# Altium schematic sheet Sheet_1 copy_2022-02-27.schdoc
size 312 x 225 mm
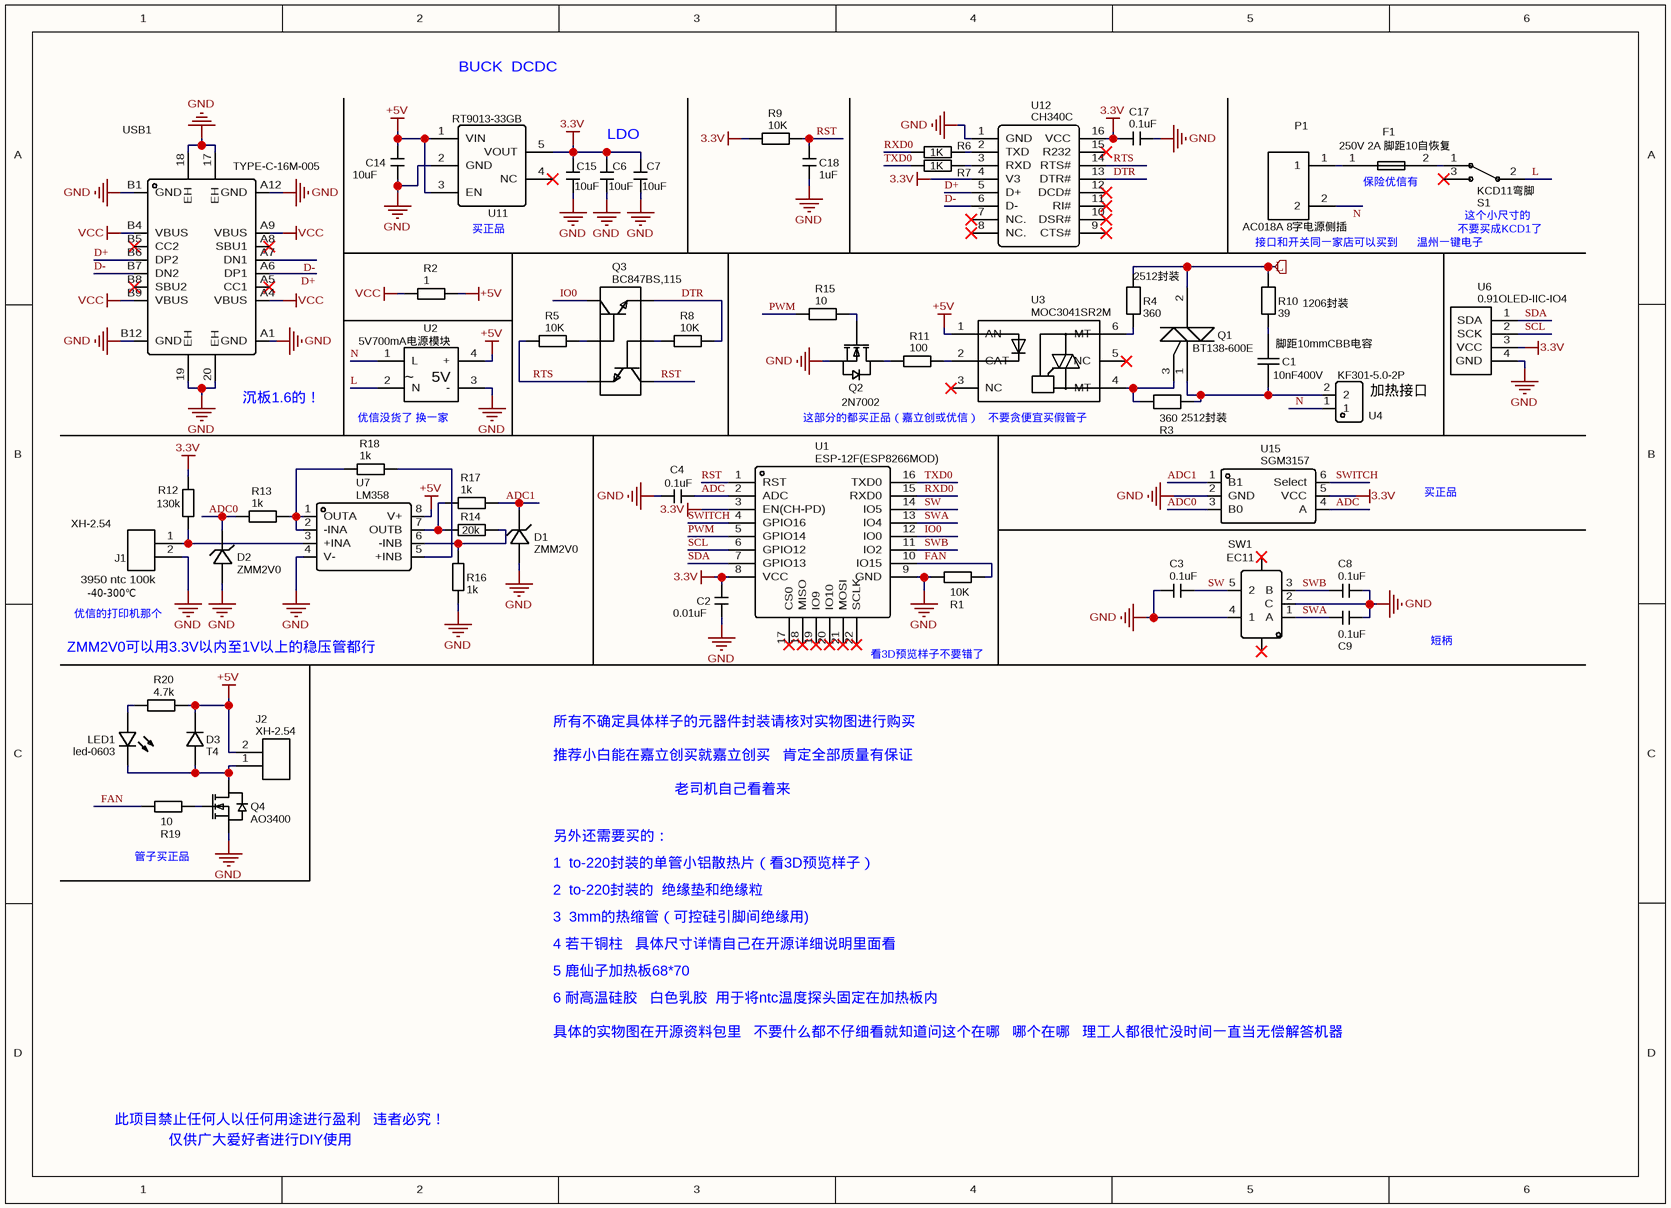
[diagram p0: Sheet_1 copy_2022-02-27.schdoc]

## Parts
C1  10nF400V  [CAP-TH_L13.0-W6.5-P10.00-D1.2]
C2  0.01uF  [CAP 0603]
C3  0.1uF  [CAP 0603]
C4  0.1uF  [CAP 0603]
C6  10uF  [CAP 0603]
C7  10uF  [CAP 0603]
C8  0.1uF  [CAP 0603]
C9  0.1uF  [CAP 0603]
C14  10uF  [CAP 0603]
C15  10uF  [CAP 0603]
C17  0.1uF  [CAP 0603]
C18  1uF  [CAP 0603]
D1  ZMM2V0  [LL-34_L3.5-W1.5-RD]
D2  ZMM2V0  [LL-34_L3.5-W1.5-RD]
D3  T4  [SOD-323_L1.8-W1.3-LS2.5-RD]
F1  250V 2A 脚距10自恢复  [FUSE-TH_L17.5-W3.1-P10.50-D0.8-S2.30]
J1  XH-2.54  [XH-2.54-TH-2P]
J2  XH-2.54  [XH-2.54-TH-2P]
LED1  led-0603  [LED-0603]
P1  AC018A 8字电源侧插  [8字电源座侧插]
Q1  BT138-600E  [TO-220-3_L10.0-W4.5-P2.54-L]
Q2  2N7002  [SOT-23-3_L2.9-W1.3-P1.90-LS2.4-BR]
Q3  BC847BS,115  [SOT-363_L2.0-W1.3-P0.65-LS2.1-TL]
Q4  AO3400  [SOT-23-3_L2.9-W1.3-P1.90-LS2.4-BR]
R1  10K  [RES-0603]
R2  1  [RES-0603]
R3  360  [R2512]
R4  360  [R2512]
R5  10K  [RES-0603]
R6  1K  [RES-0603]
R7  1K  [RES-0603]
R8  10K  [RES-0603]
R9  10K  [RES-0603]
R10  39  [R1206]
R11  100  [RES-0603]
R12  130k  [RES-0603]
R13  1k  [RES-0603]
R14  20k  [RES-0603]
R15  10  [RES-0603]
R16  1k  [RES-0603]
R17  1k  [RES-0603]
R18  1k  [RES-0603]
R19  10  [RES-0603]
R20  4.7k  [RES-0603]
S1  KCD11弯脚  [船型开关15-10]
SW1  EC11  [SW-TH_5P-L11.8-W12.0-P2.50-LS14.5]
U1  ESP-12F(ESP8266MOD)  [WIFIM-SMD_ESP-12F-ESP8266MOD]
U2  5V700mA电源模块  [5V700MA]
U3  MOC3041SR2M  [SOP-6_L8.5-W6.4-P2.54-LS9.2-BL]
U4  KF301-5.0-2P  [CONN-TH_P5.00_KF301-5.0-2P]
U6  0.91OLED-IIC-IO4  [0.91-OLED-IIC-12832]
U7  LM358  [SOP-8_L4.9-W3.9-P1.27-LS6.0-BL]
U11  RT9013-33GB  [SOT-23-5_L3.0-W1.7-P0.95-LS2.8-BR]
U12  CH340C  [SOP-16_L10.0-W3.9-P1.27-LS6.0-BL]
U15  SGM3157  [SC-70-6_L2.2-W1.3-P0.65-LS2.2-BR]
USB1  TYPE-C-16M-005  [USB-C-SMD_TYPE-C-16M-005]

## Ports
L (in)

## Nets
3.3V: C2.2 C6.1 C7.1 C15.1 C17.1 R9.1 R12.2 U1.3(EN(CH-PD)) U1.8(VCC) U6.3(VCC) U11.5(VOUT) U12.4(V3) U12.16(VCC) U15.5(VCC)
+5V: C14.1 D3.1(C) J2.2 R2.2 R20.1 U2.4(+) U3.1(AN) U7.8(V+) U11.1(VIN) U11.3(EN)
GND: C2.1 C3.1 C4.1 C6.2 C7.2 C8.2 C9.2 C14.2 C15.2 C17.2 C18.2 D1.2(A) D2.2(A) J1.2 Q2.2(S) Q4.2(S) R1.2 R16.1 SW1.2(C) SW1.4(1) U1.9(GND) U2.3(-) U6.4(GND) U7.4(V-) U11.2(GND) U12.1(GND) U15.2(GND) USB1.17(EH) USB1.18(EH) USB1.19(EH) USB1.20(EH) USB1.A1(GND) USB1.A12(GND) USB1.B1(GND) USB1.B12(GND)
VCC: R2.1 USB1.A4(VBUS) USB1.A9(VBUS) USB1.B4(VBUS) USB1.B9(VBUS)
ADC: C4.2 U1.2(ADC) U15.4(A)
ADC0: D2.1(C) R13.1 U15.3(B0)
ADC1: D1.1(C) R17.2 U15.1(B1)
D+: U12.5(D+) USB1.A6(DP1) USB1.B6(DP2)
D-: U12.6(D-) USB1.A7(DN1) USB1.B7(DN2)
DTR: Q3.4 R8.1 U12.13(DTR#)
FAN: R1.1 R19.2 U1.10(IO15)
IO0: Q3.3 U1.12(IO0)
L: S1.2 U2.2(N)
L: Q1.2(T2) R4.1 R10.2 ; port L  [a separate net that carries the same name]
N: P1.2 U2.1(L) U4.1
PWM: R15.1 U1.5(GPIO14)
RST: C18.1 Q3.6 R9.2 U1.1(RST)
RTS: Q3.1 R5.2 U12.14(RTS#)
RXD0: R6.1 U1.15(RXD0)
SCL: U1.6(GPIO12) U6.2(SCK)
SDA: U1.7(GPIO13) U6.1(SDA)
SW: C3.2 SW1.5(2) U1.14(IO5)
SWA: C9.1 SW1.1(A) U1.13(IO4)
SWB: C8.1 SW1.3(B) U1.11(IO2)
SWITCH: U1.4(GPIO16) U15.6(Select)
TXD0: R7.1 U1.16(TXD0)
NetC1_1: C1.1 Q1.1(T1) R3.1 U4.2
NetC1_2: C1.2 R10.1
NetD3_2: D3.2(A) J2.1 LED1.1(C) Q4.3(D)
NetF1_1: F1.1 P1.1
NetF1_2: F1.2 S1.1
NetJ1_1: J1.1 R12.1 U7.3(+INA)
NetLED1_2: LED1.2(A) R20.2
NetQ1_3: Q1.3(G) R3.2 U3.4(MT)
NetQ2_1: Q2.1(G) R15.2
NetQ2_3: Q2.3(D) R11.1
NetQ3_2: Q3.2 R8.2
NetQ3_5: Q3.5 R5.1
NetQ4_1: Q4.1(G) R19.1
NetR4_2: R4.2 U3.6(MT)
NetR6_2: R6.2 U12.2(TXD)
NetR7_2: R7.2 U12.3(RXD)
NetR11_2: R11.2 U3.2(CAT)
NetR13_2: R13.2 R18.2 U7.1(OUTA) U7.2(-INA)
NetR14_1: R14.1 R16.2 U7.6(-INB)
NetR14_2: R14.2 R17.1 U7.7(OUTB)
NetR18_1: R18.1 U7.5(+INB)

Not connected (* = marked no-connect by the designer): S1 3*; SW1 7* 8*; U1 17(CS0)* 18(MISO)* 19(IO9)* 20(IO10)* 21(MOSI)* 22(SCLK)*; U3 3(NC)* 5(NC)*; U11 4(NC)*; U12 7(NC.)* 8(NC.)* 9(CTS#)* 10(DSR#)* 11(RI#)* 12(DCD#)* 15(R232)*; USB1 A5(CC1)* A8(SBU1)* B5(CC2)* B8(SBU2)*

## Notes on the sheet
- BUCK  DCDC
- LDO
- (near F1) 保险优信有
- (near S1) 这个小尺寸的
- (near U11) 买正品
- (near R4) 2512封装
- 接口和开关同一家店可以买到
- 温州一键电子
- (near S1) 不要买成KCD1了
- (near C1) 脚距10mmCBB电容
- 1206封装
- (near USB1) 沉板1.6的！
- (near U2) 优信没货了 换一家
- 这部分的都买正品（嘉立创或优信）   不要贪便宜买假管子
- (near R3) 2512封装
- (near U4) 加热接口
- 买正品
- 优信的打印机那个
- (near J1) 3950 ntc 100k
- (near J1) -40-300℃
- ZMM2V0可以用3.3V以内至1V以上的稳压管都行
- (near U1) 看3D预览样子不要错了
- 短柄
- 所有不确定具体样子的元器件封装请核对实物图进行购买
- 推荐小白能在嘉立创买就嘉立创买   肯定全部质量有保证
- 老司机自己看着来
- 管子买正品
- 另外还需要买的：
- 1  to-220封装的单管小铝散热片（看3D预览样子）
- 2  to-220封装的  绝缘垫和绝缘粒
- 3  3mm的热缩管（可控硅引脚间绝缘用)
- 4 若干铜柱   具体尺寸详情自己在开源详细说明里面看
- 5 鹿仙子加热板68*70
- 6 耐高温硅胶   白色乳胶  用于将ntc温度探头固定在加热板内
- 具体的实物图在开源资料包里   不要什么都不仔细看就知道问这个在哪   哪个在哪   理工人都很忙没时间一直当无偿解答机器
- 此项目禁止任何人以任何用途进行盈利   违者必究！
- 仅供广大爱好者进行DIY使用
- (in symbol 5V700mA电源模块) ~; 5V

## Library data of the parts
C1 = 10nF400V: BOM_Manufacturer: Tongfeng; BOM_Manufacturer Part: CBB21-0.15uF400V 5%; nameAlias: Capacitance; Contributor: LCSC; BOM_Supplier: LCSC; BOM_Supplier Part: C281882; BOM_JLCPCB Part Class: Extended Part; spicePre: C; spiceSymbolName: CBB21-0.15UF400V 5%
C2 = 0.01uF: BOM_Manufacturer: KEMET; BOM_Manufacturer Part: C0603C104K3RACAUTO; nameAlias: Capacitance; Contributor: dhx233; BOM_Supplier: LCSC; BOM_Supplier Part: C172738; spicePre: C; spiceSymbolName: cap 0603
C3 C4 C8 C9 C17 = 0.1uF: BOM_Manufacturer: KEMET; BOM_Manufacturer Part: C0603C104K3RACAUTO; nameAlias: Capacitance; Contributor: dhx233; BOM_Supplier: LCSC; BOM_Supplier Part: C172738; spicePre: C; spiceSymbolName: cap 0603
C6 C7 C14 C15 = 10uF: BOM_Manufacturer: KEMET; BOM_Manufacturer Part: C0603C104K3RACAUTO; nameAlias: Capacitance; Contributor: dhx233; BOM_Supplier: LCSC; BOM_Supplier Part: C172738; spicePre: C; spiceSymbolName: cap 0603
C18 = 1uF: BOM_Manufacturer: KEMET; BOM_Manufacturer Part: C0603C104K3RACAUTO; nameAlias: Capacitance; Contributor: dhx233; BOM_Supplier: LCSC; BOM_Supplier Part: C172738; spicePre: C; spiceSymbolName: cap 0603
D1 D2 = ZMM2V0: BOM_Manufacturer: PANJIT International; BOM_Manufacturer Part: ZMM55-C5V1; Contributor: LCSC; BOM_Supplier: LCSC; BOM_Supplier Part: C305343; BOM_JLCPCB Part Class: Extended Part; spicePre: D; spiceSymbolName: ZMM55-C5V1
D3 = T4: BOM_Manufacturer: DIODES; BOM_Manufacturer Part: 1N4148WS-7-F; BOM_Supplier: LCSC; BOM_Supplier Part: C60580; BOM_JLCPCB Part Class: Extended Part; spicePre: D; spiceSymbolName: 1N4148WS-7-F
F1 = 250V 2A 脚距10自恢复: BOM_Manufacturer: ValuePro; BOM_Manufacturer Part: RL30-700; BOM_Supplier: LCSC; BOM_Supplier Part: C20851; spicePre: F; spiceSymbolName: RL30-700
J1 J2 = XH-2.54: BOM_Manufacturer: ReliaPro; BOM_Manufacturer Part: WJ301V-5.0-2P; Contributor: dhx233; BOM_Supplier Part: C8475; BOM_Supplier: LCSC; image: //image.lceda.cn/szlcsc/C8475.jpg; spicePre: J; spiceSymbolName: XH-2.54-TH-2P
LED1 = led-0603: BOM_Manufacturer: EVERLIGHT; BOM_Manufacturer Part: 17-21SURC/S530-A3/TR8; SMT Type: Extend; Contributor: 启凡科创官方; BOM_Supplier: LCSC; image: //image.lceda.cn/szlcsc/C72037.jpg; BOM_Supplier Part: C72037; BOM_LCSC Assembly: Yes; spicePre: L; spiceSymbolName: led-0603
P1 = AC018A 8字电源侧插: Contributor: dhx233; spicePre: P; spiceSymbolName: 8字电源侧插
Q1 = BT138-600E: BOM_Manufacturer Part: BT138-600E,127; BOM_Manufacturer: WeEn Semiconductors; BOM_Supplier: LCSC; BOM_Supplier Part: C14796; BOM_JLCPCB Part Class: Extended Part; spicePre: Q; spiceSymbolName: BT138-600E,127
Q2 = 2N7002: BOM_Manufacturer: CJ; BOM_Supplier: LCSC; BOM_Manufacturer Part: 2N7002; BOM_Supplier Part: C8545; BOM_JLCPCB Part Class: Basic Part; spicePre: Q; spiceSymbolName: 2N7002
Q3 = BC847BS,115: BOM_Manufacturer: Nexperia; BOM_Supplier: LCSC; BOM_Manufacturer Part: BC847BS,115; BOM_Supplier Part: C8653; BOM_JLCPCB Part Class: Extended Part; spicePre: Q; spiceSymbolName: BC847BS,115
Q4 = AO3400: BOM_Manufacturer: LGE; Contributor: LCSC; BOM_Supplier: LCSC; BOM_Supplier Part: C841146; BOM_Manufacturer Part: AO3400; BOM_JLCPCB Part Class: Extended Part; spicePre: Q; spiceSymbolName: AO3400_C841146
R1 R5 R8 R9 = 10K: BOM_Manufacturer: Viking Tech; BOM_Manufacturer Part: ARG03BTC3003; nameAlias: Resistance (Ohms); Contributor: dhx233; BOM_Supplier: LCSC; BOM_Supplier Part: C335091; spicePre: R; spiceSymbolName: res-0603
R2 = 1: BOM_Manufacturer: Viking Tech; BOM_Manufacturer Part: ARG03BTC3003; nameAlias: Resistance (Ohms); Contributor: dhx233; BOM_Supplier: LCSC; BOM_Supplier Part: C335091; spicePre: R; spiceSymbolName: res-0603
R3 R4 = 360: nameAlias: Value(Ω); Contributor: LCEDA_Lib; spicePre: R; spiceSymbolName: R_2512_EU
R6 R7 = 1K: BOM_Manufacturer: Viking Tech; BOM_Manufacturer Part: ARG03BTC3003; nameAlias: Resistance (Ohms); Contributor: dhx233; BOM_Supplier: LCSC; BOM_Supplier Part: C335091; spicePre: R; spiceSymbolName: res-0603
R10 = 39: nameAlias: Value(Ω); Contributor: LCEDA_Lib; spicePre: R; spiceSymbolName: R_1206_EU
R11 = 100: BOM_Manufacturer: Viking Tech; BOM_Manufacturer Part: ARG03BTC3003; nameAlias: Resistance (Ohms); Contributor: dhx233; BOM_Supplier: LCSC; BOM_Supplier Part: C335091; spicePre: R; spiceSymbolName: res-0603
R12 = 130k: BOM_Manufacturer: Viking Tech; BOM_Manufacturer Part: ARG03BTC3003; nameAlias: Resistance (Ohms); Contributor: dhx233; BOM_Supplier: LCSC; BOM_Supplier Part: C335091; spicePre: R; spiceSymbolName: res-0603
R13 R16-R18 = 1k: BOM_Manufacturer: Viking Tech; BOM_Manufacturer Part: ARG03BTC3003; nameAlias: Resistance (Ohms); Contributor: dhx233; BOM_Supplier: LCSC; BOM_Supplier Part: C335091; spicePre: R; spiceSymbolName: res-0603
R14 = 20k: BOM_Manufacturer: Viking Tech; BOM_Manufacturer Part: ARG03BTC3003; nameAlias: Resistance (Ohms); Contributor: dhx233; BOM_Supplier: LCSC; BOM_Supplier Part: C335091; spicePre: R; spiceSymbolName: res-0603
R15 R19 = 10: BOM_Manufacturer: Viking Tech; BOM_Manufacturer Part: ARG03BTC3003; nameAlias: Resistance (Ohms); Contributor: dhx233; BOM_Supplier: LCSC; BOM_Supplier Part: C335091; spicePre: R; spiceSymbolName: res-0603
R20 = 4.7k: BOM_Manufacturer: Viking Tech; BOM_Manufacturer Part: ARG03BTC3003; nameAlias: Resistance (Ohms); Contributor: dhx233; BOM_Supplier: LCSC; BOM_Supplier Part: C335091; spicePre: R; spiceSymbolName: res-0603
S1 = KCD11弯脚: Contributor: 启凡科创官方; spicePre: S; spiceSymbolName: 船型开关15-10
SW1 = EC11: BOM_Manufacturer: BOURNS; BOM_Manufacturer Part: PEC11L-4115F-S0020; Contributor: LCSC; BOM_Supplier: LCSC; BOM_Supplier Part: C143799; BOM_JLCPCB Part Class: Extended Part; spicePre: S; spiceSymbolName: PEC11L-4115F-S0020
U1 = ESP-12F(ESP8266MOD): BOM_Manufacturer: Ai-Thinker; BOM_Supplier: LCSC; BOM_Manufacturer Part: ESP-12F(ESP8266MOD); BOM_Supplier Part: C82891; BOM_JLCPCB Part Class: Extended Part; spicePre: U; spiceSymbolName: ESP-12F(ESP8266MOD)
U2 = 5V700mA电源模块: Contributor: dhx233; spicePre: U; spiceSymbolName: 5V700mA电源模块
U3 = MOC3041SR2M: BOM_Manufacturer: FAIRCHILD; BOM_Supplier: LCSC; BOM_Manufacturer Part: MOC3041SR2M; BOM_Supplier Part: C33904; BOM_JLCPCB Part Class: Extended Part; spicePre: U; spiceSymbolName: MOC3041SR2M
U4 = KF301-5.0-2P: BOM_Manufacturer: Cixi Kefa Elec; Contributor: LCSC; BOM_Supplier: LCSC; BOM_Supplier Part: C474881; BOM_Manufacturer Part: KF301-5.0-2P; BOM_JLCPCB Part Class: Extended Part; spicePre: U; spiceSymbolName: KF301-5.0-2P
U6 = 0.91OLED-IIC-IO4: Contributor: dhx233; spicePre: U; spiceSymbolName: 0.91OLED-IIC-IO4
U7 = LM358: BOM_Manufacturer: RUNIC(润石); BOM_Manufacturer Part: LM358XK; Contributor: LCSC; BOM_Supplier: LCSC; BOM_Supplier Part: C2762325; BOM_JLCPCB Part Class: Extended Part; spicePre: U; spiceSymbolName: LM358XK
U11 = RT9013-33GB: BOM_Manufacturer: RICHTEK; BOM_Supplier: LCSC; BOM_Manufacturer Part: RT9013-33GB; BOM_Supplier Part: C47773; BOM_JLCPCB Part Class: Extended Part; spicePre: U; spiceSymbolName: RT9013-33GB
U12 = CH340C: BOM_Manufacturer: WCH; BOM_Supplier: LCSC; BOM_Manufacturer Part: CH340C; BOM_Supplier Part: C84681; BOM_JLCPCB Part Class: Extended Part; spicePre: U; spiceSymbolName: CH340C
U15 = SGM3157: BOM_Manufacturer: Youtai Semiconductor Co., Ltd.; Contributor: LCSC; BOM_Supplier: LCSC; BOM_Supplier Part: C394901; BOM_Manufacturer Part: SGM3157; BOM_JLCPCB Part Class: Extended Part; spicePre: U; spiceSymbolName: SGM3157
USB1 = TYPE-C-16M-005: BOM_Manufacturer: USAKRO(美韩); Contributor: LCSC; BOM_Supplier: LCSC; BOM_Supplier Part: C2798173; BOM_Manufacturer Part: TYPE-C-16M-005; spicePre: U; spiceSymbolName: TYPE-C-16M-005